# Altium schematic sheet 1XGSH00_POWER.SchDoc
size A4
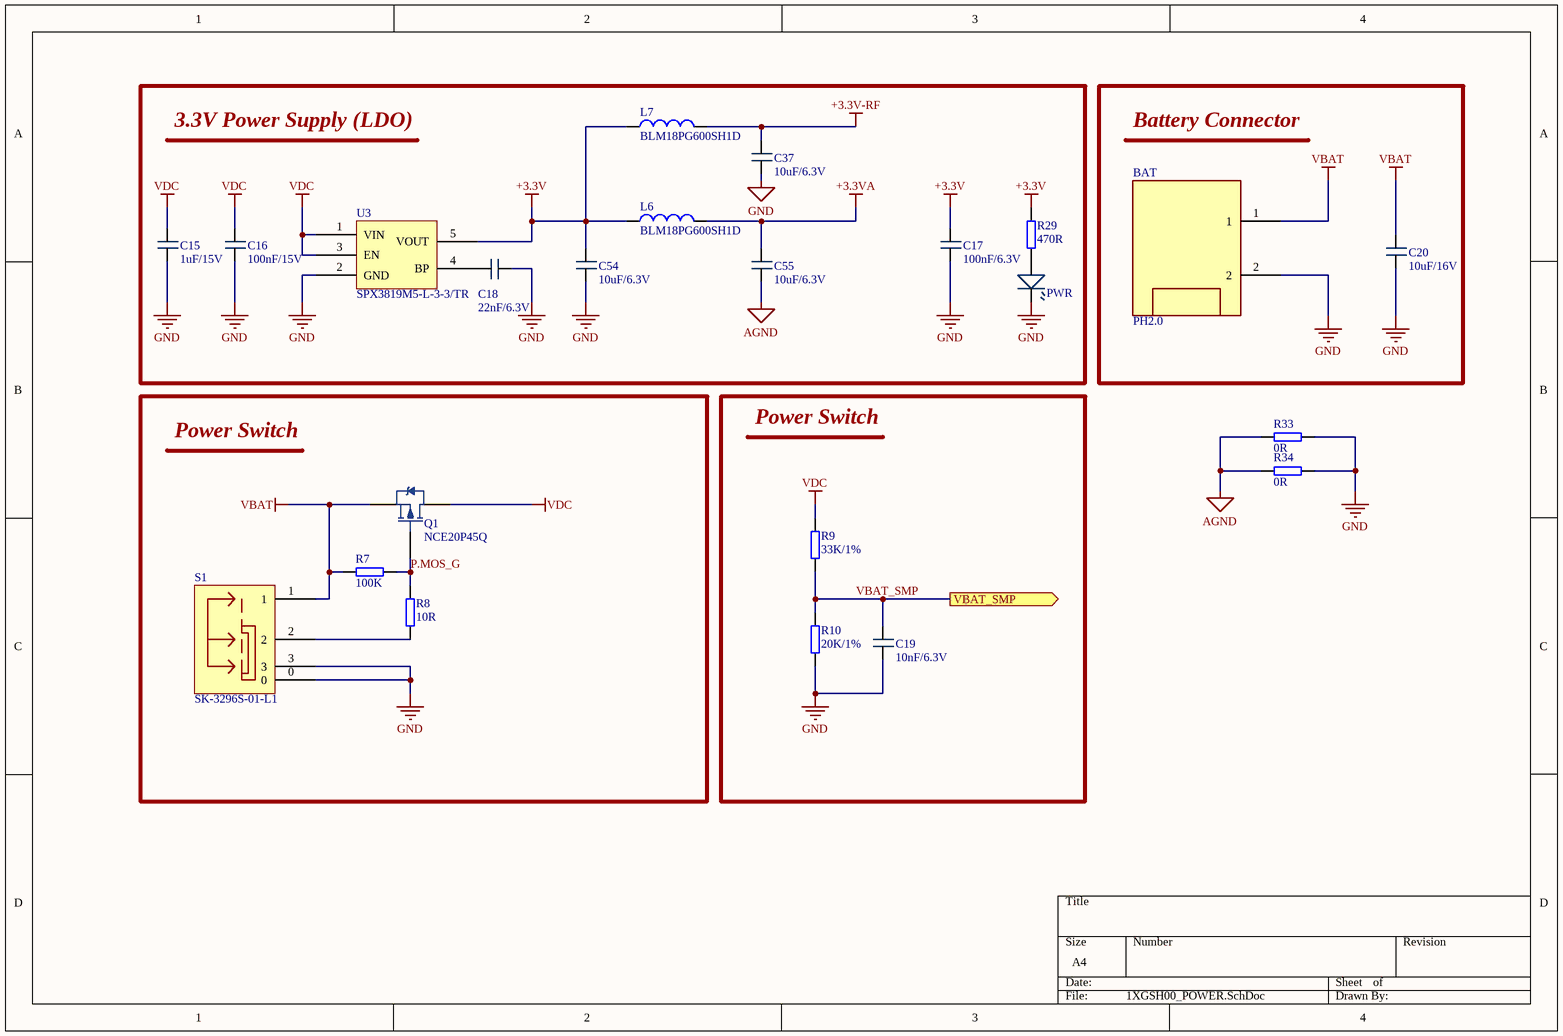
[diagram p0: 1XGSH00_POWER.SchDoc]

## Parts
BAT  PH2.0  [A2001WV-2P]
C15  1uF/15V  [0603_C]
C16  100nF/15V  [0402_C]
C17  100nF/6.3V  [0402_C]
C18  22nF/6.3V  [0402_C]
C19  10nF/6.3V  [0402_C]
C20  10uF/16V  [0805_C]
C37  10uF/6.3V  [0805_C]
C54  10uF/6.3V  [0603_C]
C55  10uF/6.3V  [0603_C]
L6  BLM18PG600SH1D  [0603_L]
L7  BLM18PG600SH1D  [0603_L]
PWR  LED  [0603_LED_S1]  (value not drawn)
Q1  NCE20P45Q  [DFN3.3*3.3]
R7  100K  [0402_R]
R8  10R  [0402_R]
R9  33K/1%  [0402_R]
R10  20K/1%  [0402_R]
R29  470R  [0402_R]
R33  0R  [0603_R]
R34  0R  [0603_R]
S1  SK-3296S-01-L1  [SW-SMD_3P-SK-3296S-01-L1]
U3  SPX3819M5-L-3-3/TR  [SOT-23-5]

## Blocks framed on the sheet
3.3V Power Supply (LDO): C15-C18 C37 C54 C55 L6 L7 PWR R29 U3
Battery Connector: BAT C20
Power Switch: Q1 R7 R8 S1
Power Switch: C19 R9 R10

## Ports
VBAT_SMP (out)

## Nets
+3.3V: C17.2(-) C54.2(-) L6.1 L7.1 R29.1 U3.5(VOUT)
+3.3V-RF: C37.2(-) L7.2
+3.3VA: C55.2(-) L6.2
AGND: C55.1(-) R33.1 R34.1
GND: BAT.2 C15.1(-) C16.1(-) C17.1(-) C18.2(-) C19.1(-) C20.1(-) C37.1(-) C54.1(-) PWR.2 R10.2 R33.2 R34.2 S1.0 S1.3 U3.2(GND)
VBAT: BAT.1 C20.2(-) Q1.S R7.1 S1.1
VDC: C15.2(-) C16.2(-) Q1.D R9.1 U3.1(VIN) U3.3(EN)
P.MOS_G: Q1.G R7.2 R8.1
VBAT_SMP: C19.2(-) R9.2 R10.1 ; port VBAT_SMP
NetC18_1: C18.1(-) U3.4(BP)
NetPWR_1: PWR.1 R29.2
NetR8_2: R8.2 S1.2

## Library data of the parts
BAT = XH2.5: XH2.5 Connector
C15-C20 C37 C54 C55 = Capacitor
L6 L7 = Inductor: Code_IEC: 1005; Published: 8-Jun-2000; LatestRevisionDate: 29-May-2009; LatestRevisionNote: IPC-7351 Footprint Added.; PackageReference: 0402-A; Publisher: Altium Limited; PackageDescription: Chip Inductor; Code_JEITA: 0402
Q1 = NCE20P45Q: P-Channel MOSFET
R7-R10 R29 R33 R34 = Resistor: Value: 1K
S1 = SW_SPDT: SPDT Swtch Slide
U3 = RT9193: RT9193-LDO